# EAGLE schematic PulseFit-THT (EAGLE 7.3.0)
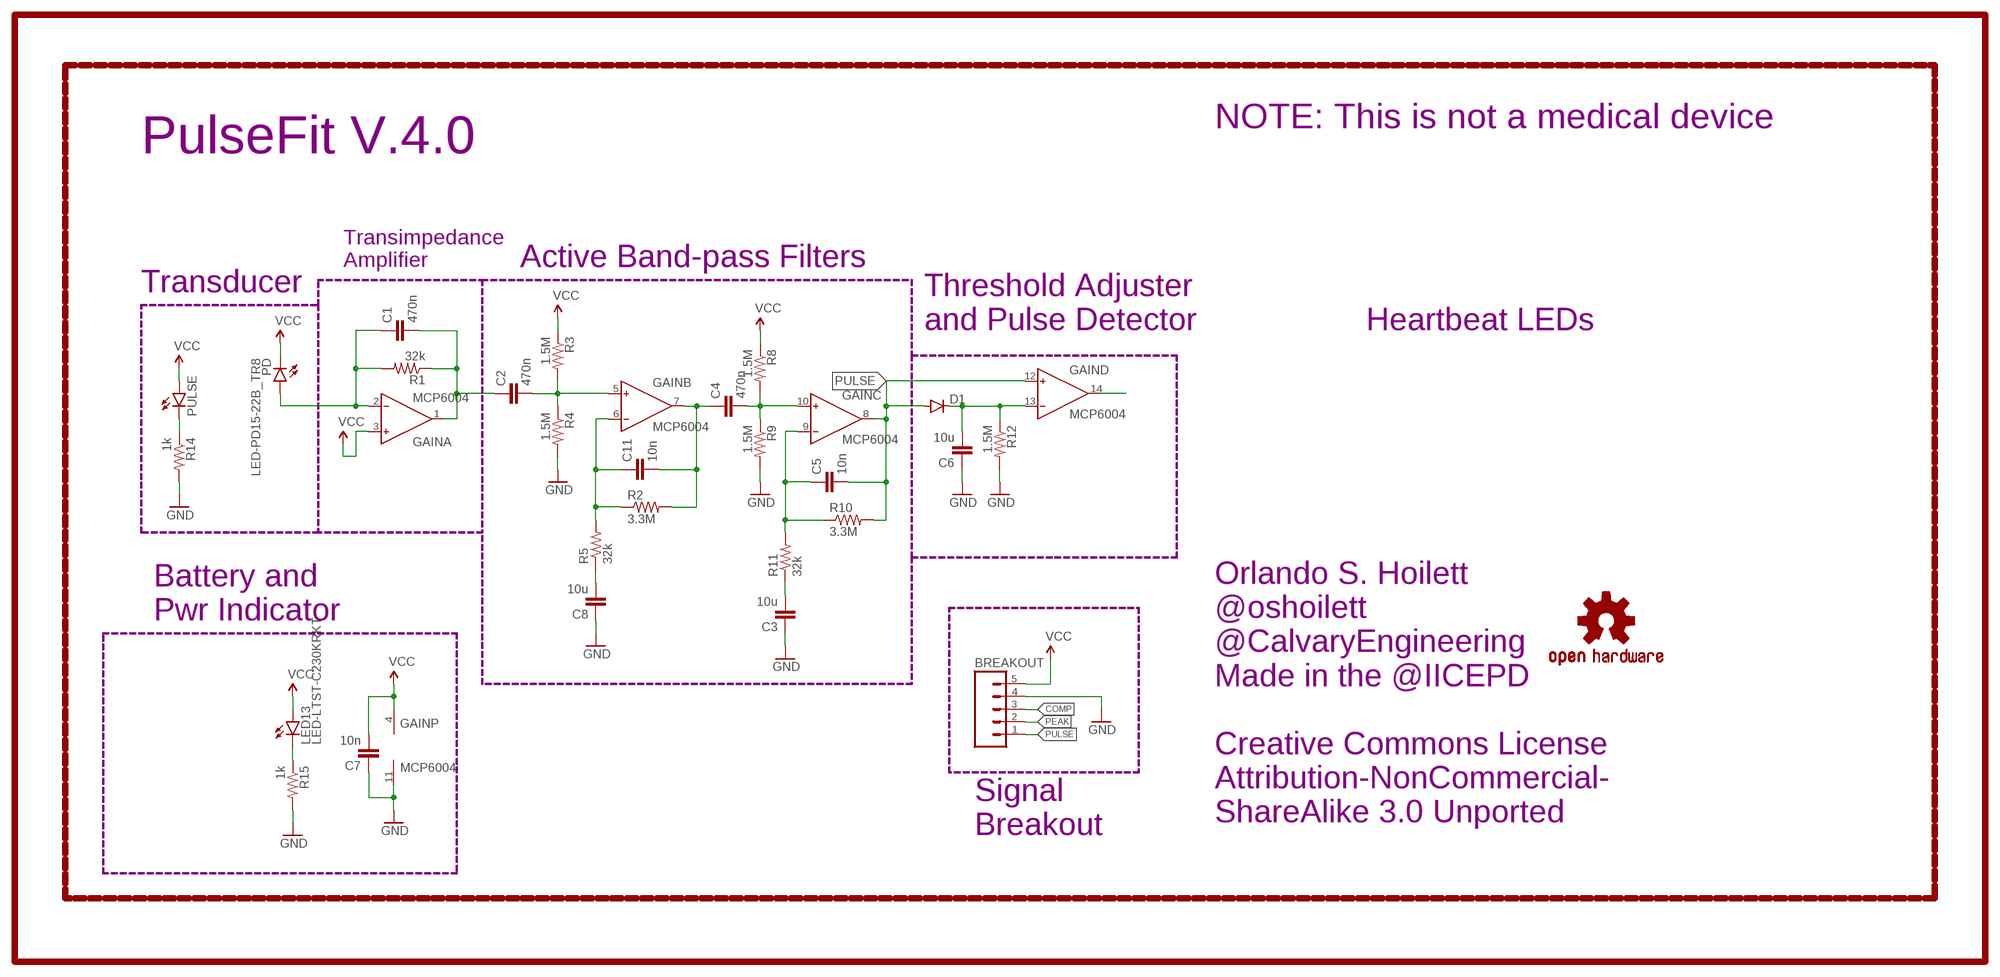
[diagram p0: schematic, sheet 1]

## Parts
BREAKOUT  M05NO_SILK  [1X05_NO_SILK]
C1  470n  C-EUC0402  [C0402]
C2  470n  C-EUC0402  [C0402]
C3  10u  C-EUC0805  [C0805]
C4  470n  C-EUC0402  [C0402]
C5  10n  C-EUC0402  [C0402]
C6  10u  C-EUC0805  [C0805]
C7  10n  C-EUC0402  [C0402]
C8  10u  C-EUC0805  [C0805]
C11  10n  C-EUC0402  [C0402]
D1  250mA/100V  DIODEBAS16  [SOD-323]
GAIN  MCP6004  AD8609RU  [TSSOP14]
LED13  LED-LTST-C230KRKT  [LED-1206-BOTTOM]
LOGO1  OSHW-LOGOS  [OSHW-LOGO-S]
PD  LED-PD15-22B_TR8  [LED-PD15-22B_TR8]
PULSE  LED0603  [LED-0603]
R1  32k  R-US_R0402  [R0402]
R2  3.3M  R-US_R0402  [R0402]
R3  1.5M  R-US_R0402  [R0402]
R4  1.5M  R-US_R0402  [R0402]
R5  32k  R-US_R0402  [R0402]
R8  1.5M  R-US_R0402  [R0402]
R9  1.5M  R-US_R0402  [R0402]
R10  3.3M  R-US_R0402  [R0402]
R11  32k  R-US_R0402  [R0402]
R12  1.5M  R-US_R0402  [R0402]
R14  1k  R-US_R0402  [R0402]
R15  1k  R-US_R0402  [R0402]

## Nets
COMP: BREAKOUT.3 GAIN.14(D:OUT)
GND: BREAKOUT.4 C3.1 C6.1 C7.1 C8.1 GAIN.11(P:V-) R4.2 R9.2 R12.2 R14.2 R15.2
N$1: C1.1 GAIN.2(A:IN-) PD.A-1(A) PD.A-2(A) R1.2
N$2: C1.2 C2.1 GAIN.1(A:OUT) R1.1
N$3: C4.2 GAIN.10(C:IN+) R8.2 R9.1
N$4: C2.2 GAIN.5(B:IN+) R3.2 R4.1
N$6: C3.2 R11.1
N$8: C5.1 GAIN.9(C:IN-) R10.1 R11.2
N$9: PULSE.C R14.1
N$10: C11.1 GAIN.6(B:IN-) R2.1 R5.2
N$11: C4.1 C11.2 GAIN.7(B:OUT) R2.2
N$12: LED13.C R15.1
N$14: C8.2 R5.1
PEAK: BREAKOUT.2 C6.2 D1.C GAIN.13(D:IN-) R12.1
PULSE: BREAKOUT.1 C5.2 D1.A GAIN.8(C:OUT) GAIN.12(D:IN+) R10.2
VCC: BREAKOUT.5 C7.2 GAIN.3(A:IN+) GAIN.4(P:V+) LED13.A PD.C-1(C) PD.C-2(C) PULSE.A R3.1 R8.1

## Notes on the sheet
- NOTE: This is not a medical device
- PulseFit V.4.0
- Transimpedance
  Amplifier
- Active Band-pass Filters
- Transducer
- Threshold Adjuster
  and Pulse Detector
- Heartbeat LEDs
- Battery and
  Pwr Indicator
- Orlando S. Hoilett
  @oshoilett
  @CalvaryEngineering
  Made in the @IICEPD
  
  Creative Commons License
  Attribution-NonCommercial-
  ShareAlike 3.0 Unported
- Signal
  Breakout

## Library data of the parts
BREAKOUT = SparkFun-Connectors:M05: Header 5 Standard 5-pin 0.1" header. Use with straight break away headers (SKU : PRT-00116), right angle break away headers (PRT-00553), swiss pins (PRT-00743), machine pins (PRT-00117), and female headers (PRT-00115). Molex polarized connector foot print use with SKU : PRT-08230 with associated crimp pins and housings.
C1-C8 C11 = resistor:C-EU: CAPACITOR, European symbol
D1 = SparkFun-DiscreteSemi:DIODE: Diode These are standard reverse protection diodes and small signal diodes. SMA package can handle up to about 1A. SOD-323 can handle about 200mA. What the SOD-323 package when ordering, there are some mfgs out there that are 5-pin packages.; PROD_ID: DIO-09646
GAIN = analog-devices:AD8609: Precision Micropower, Low Noise CMOS, Rail-to-Rail Input/Output Operational Amplifiers Source: http://www.analog.com/static/imported-files/data_sheets/AD8603_8607_8609.pdf; MF: ALTERA CORPORATION; MPN: AD8609ARUZ; OC_FARNELL: 1464994; OC_NEWARK: 59K6934
LED13 = Orlando:LED-LTST-C230KRKT
LOGO1 = SparkFun-Aesthetics:OSHW-LOGO: Open Source Hardware Logo This logo indicates the piece of hardware it is found on incorporates a OSHW license and/or adheres to the definition of open source hardware found here: http://freedomdefined.org/OSHW
PD = Orlando:LED-PD15-22B_TR8
PULSE = SparkFun-LED:LED: LEDs Standard schematic elements and footprints for 5mm, 3mm, 1206, and 0603 sized LEDs. 5mm - Spark Fun Electronics SKU : COM-00529 (and others)
R1-R5 R8-R12 R14 R15 = resistor:R-US_: RESISTOR, American symbol